# Altium schematic sheet ad_test2.SchDoc
size A4
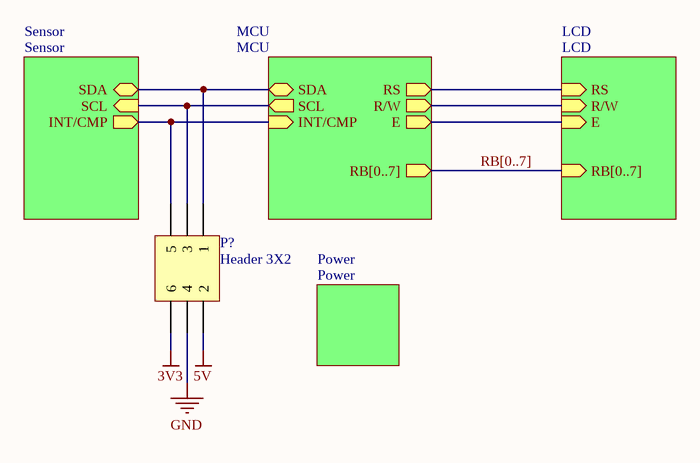
[diagram p0: ad_test2.SchDoc]

## Parts
P?  Header 3X2  [HDR2X3]

## Sub-sheets
LCD = LCD: RS (in), R/W (in), E (in), RB[0..7] (in)
MCU = MCU: SDA (bidir), SCL (out), INT/CMP (in), RS (out), R/W (out), E (out), RB[0..7] (out)
Power = Power: no entries
Sensor = Sensor: SDA (bidir), SCL (in), INT/CMP (out)

## Nets
3V3: P?.6
5V: P?.2
GND: P?.4
NetP?_1: P?.1 ; sheet Sensor/SDA, sheet MCU/SDA
NetP?_3: P?.3 ; sheet Sensor/SCL, sheet MCU/SCL
NetP?_5: P?.5 ; sheet Sensor/INT/CMP, sheet MCU/INT/CMP
(unnamed): sheet MCU/RS, sheet LCD/RS
(unnamed): sheet MCU/R/W, sheet LCD/R/W
(unnamed): sheet MCU/E, sheet LCD/E

## Buses and harness runs
bus RB[0..7] = sheet LCD/RB[0..7] = sheet MCU/RB[0..7]

## Library data of the parts
P? = Header 3X2: Header, 3-Pin, Dual row; LatestRevisionDate: 17-Jul-2002; LatestRevisionNote: Re-released for DXP Platform.; Publisher: Altium Limited